# Altium schematic sheet Alimentation 2V.schdoc
size 317 x 143 mm; SheetNumber: 1; SheetTotal: 1
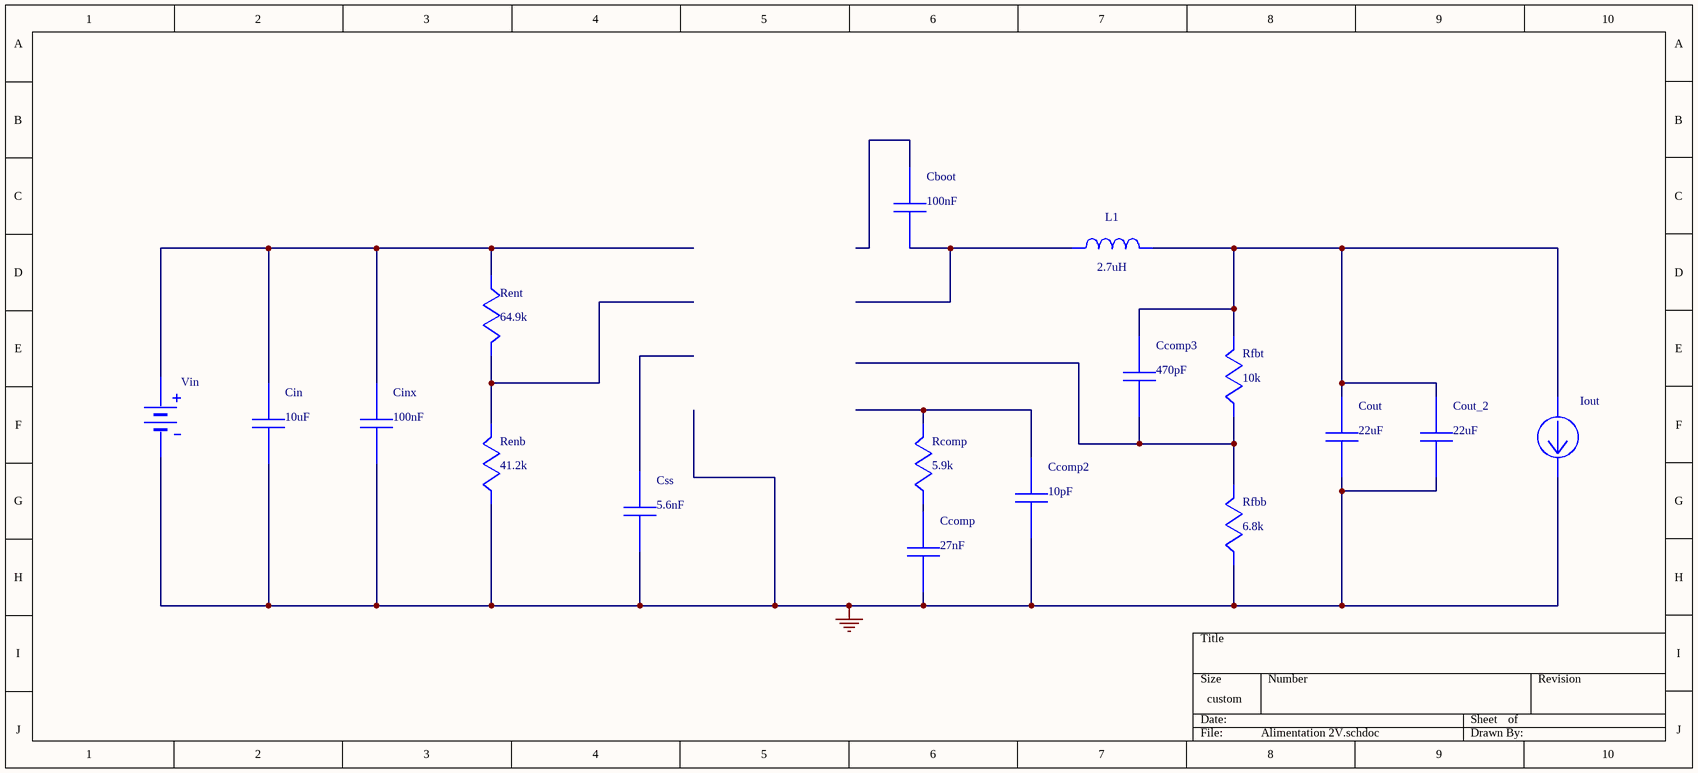
[diagram p0: Alimentation 2V.schdoc]

## Parts
Cboot  value 100nF  (hidden comment: 08053C104JAZ2A)
Ccomp  value 27nF  (hidden comment: C1812C273J5GACTU)
Ccomp2  value 10pF  (hidden comment: CL21C100JBANNNC)
Ccomp3  value 470pF  (hidden comment: CL21C471KBANNNC)
Cin  value 10uF  (hidden comment: C0805C106K8PACTU)
Cinx  value 100nF  (hidden comment: GRM155R70J104KA01D)
Cout  value 22uF  (hidden comment: GRM188R60J226MEA0D)
Cout_2  value 22uF  (hidden comment: GRM188R60J226MEA0D)
Css  value 5.6nF  (hidden comment: CGA4C2C0G1H562J060AA)
Iout  WB_CURRENT_LOAD  (value not drawn)
L1  value 2.7uH  (hidden comment: 1255AY-2R7N=P3)
Rcomp  value 5.9k  (hidden comment: CRCW04025K90FKED)
Renb  value 41.2k  (hidden comment: CRCW060341K2FKEA)
Rent  value 64.9k  (hidden comment: CRCW080564K9FKEA)
Rfbb  value 6.8k  (hidden comment: RC0603FR-076K8L)
Rfbt  value 10k  (hidden comment: RC0201FR-0710KL)
Vin  WB_BATTERY  (value not drawn)

## Nets
0: Ccomp.2 Ccomp2.2 Cin.2 Cinx.2 Cout.2 Cout_2.2 Css.2 Iout.2(-) Renb.2 Rfbb.2 Vin.2(-)
NetCboot_1: Cboot.1 L1.1
NetCcomp2_1: Ccomp2.1 Rcomp.1
NetCcomp3_1: Ccomp3.1 Rfbb.1 Rfbt.2
NetCcomp3_2: Ccomp3.2 Cout.1 Cout_2.1 Iout.1(+) L1.2 Rfbt.1
NetCcomp_1: Ccomp.1 Rcomp.2
NetCin_1: Cin.1 Cinx.1 Rent.2 Vin.1(+)
NetRenb_1: Renb.1 Rent.1

Not connected (* = marked no-connect by the designer): Cboot 2; Css 1

## Library data of the parts
Cboot = 08053C104JAZ2A: Manufacturer Name: AVX; PackageReference: 08053C104JAZ2A; Manufacturer Part Number: 08053C104JAZ2A
Ccomp = C1812C273J5GACTU: Manufacturer Name: Kemet; PackageReference: C1812C273J5GACTU; Manufacturer Part Number: C1812C273J5GACTU
Ccomp2 = CL21C100JBANNNC: Manufacturer Name: Samsung Electro-Mechanics; PackageReference: CL21C100JBANNNC; Manufacturer Part Number: CL21C100JBANNNC
Ccomp3 = CL21C471KBANNNC: Manufacturer Name: Samsung Electro-Mechanics; PackageReference: CL21C471KBANNNC; Manufacturer Part Number: CL21C471KBANNNC
Cin = C0805C106K8PACTU: Manufacturer Name: Kemet; PackageReference: C0805C106K8PACTU; Manufacturer Part Number: C0805C106K8PACTU
Cinx = GRM155R70J104KA01D: GRM155R70J104KA0; Manufacturer Name: MuRata; PackageReference: GRM155R70J104KA01D; Manufacturer Part Number: GRM155R70J104KA01D
Cout Cout_2 = GRM188R60J226MEA0D: GRM188R60J226MEA; Manufacturer Name: MuRata; PackageReference: GRM188R60J226MEA0D; Manufacturer Part Number: GRM188R60J226MEA0D
Css = CGA4C2C0G1H562J060AA: CGA4C2C0G1H562J0; Manufacturer Name: TDK; PackageReference: CGA4C2C0G1H562J060AA; Manufacturer Part Number: CGA4C2C0G1H562J060AA
L1 = 1255AY-2R7N=P3: Manufacturer Name: MuRata; PackageReference: 1255AY-2R7N=P3; Manufacturer Part Number: 1255AY-2R7N=P3
Rcomp = CRCW04025K90FKED: Manufacturer Name: Vishay-Dale; PackageReference: CRCW04025K90FKED; Manufacturer Part Number: CRCW04025K90FKED
Renb = CRCW060341K2FKEA: Manufacturer Name: Vishay-Dale; PackageReference: CRCW060341K2FKEA; Manufacturer Part Number: CRCW060341K2FKEA
Rent = CRCW080564K9FKEA: Manufacturer Name: Vishay-Dale; PackageReference: CRCW080564K9FKEA; Manufacturer Part Number: CRCW080564K9FKEA
Rfbb = RC0603FR-076K8L: Manufacturer Name: Yageo; PackageReference: RC0603FR-076K8L; Manufacturer Part Number: RC0603FR-076K8L
Rfbt = RC0201FR-0710KL: Manufacturer Name: Yageo; PackageReference: RC0201FR-0710KL; Manufacturer Part Number: RC0201FR-0710KL
Iout = WB_CURRENT_LOAD: PackageReference: WB_CURRENT_LOAD; Manufacturer Part Number: WB_CURRENT_LOAD; Manufacturer Name: WB_CURRENT_LOAD; Value: N/A
Vin = WB_BATTERY: PackageReference: WB_BATTERY; Manufacturer Part Number: WB_BATTERY; Manufacturer Name: WB_BATTERY; Value: N/A